# Altium schematic sheet Sheet_x_32.SchDoc
size A4
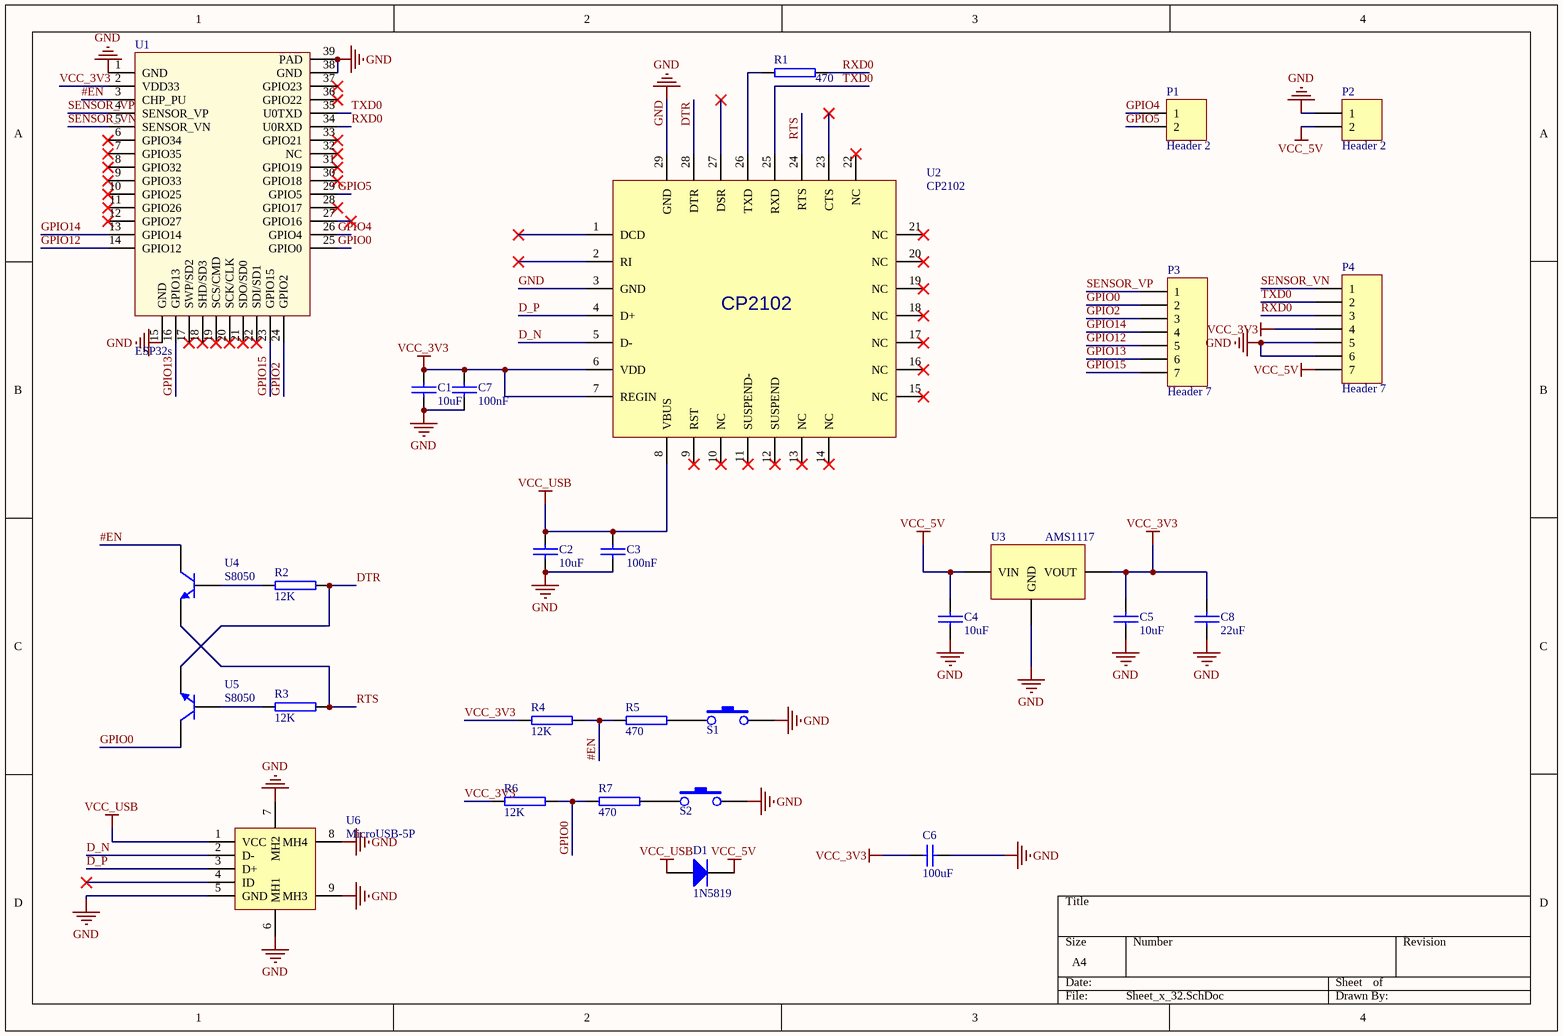
[diagram p0: Sheet_x_32.SchDoc]

## Parts
C1  10uF  [C0603]
C2  10uF  [C0603]
C3  100nF  [C0603]
C4  10uF  [C0603]
C5  10uF  [C0603]
C6  100uF  [C3528]
C7  100nF  [C0603]
C8  22uF  [C0603]
D1  1N5819  [1n4148]
P1  Header 2  [HDR1X2]
P2  Header 2  [HDR1X2]
P3  Header 7  [HDR1X7]
P4  Header 7  [HDR1X7]
R1  470  [R0603]
R2  12K  [R0603]
R3  12K  [R0603]
R4  12K  [R0603]
R5  470  [R0603]
R6  12K  [R0603]
R7  470  [R0603]
S1  贴片按钮  [switch]  (value not drawn)
S2  贴片按钮  [switch]  (value not drawn)
U1  ESP32s  [ESP32s]
U2  CP2102  [cp2102]
U3  AMS1117  [AMS1117]
U4  S8050  [s8050]
U5  S8050  [s8050]
U6  MicroUSB-5P  [MICROUSB_5S]

## Nets
GND: C1.2 C2.2 C3.2 C4.2 C5.2 C6.2 C7.2 C8.2 P2.1 P4.5 P4.6 S1.2 S2.2 U1.1(GND) U1.15(GND) U1.38(GND) U1.39(PAD) U2.3(GND) U2.29(GND) U3.1(GND) U6.5(GND) U6.6(MH1) U6.7(MH2) U6.8(MH4) U6.9(MH3)
VCC_3V3: C1.1 C5.1 C6.1 C7.1 C8.1 P4.4 R4.2 R6.2 U1.2(VDD33) U2.6(VDD) U2.7(REGIN) U3.2(VOUT)
VCC_5V: C4.1 D1.2(K) P2.2 P4.7 U3.3(VIN)
VCC_USB: C2.1 C3.1 D1.1(A) U2.8(VBUS) U6.1(VCC)
#EN: R4.1 R5.2 U1.3(CHP_PU) U4.3(C)
D_N: U2.5(D-) U6.2(D-)
D_P: U2.4(D+) U6.3(D+)
DTR: R2.2 U2.28(DTR) U5.2(E)
GPIO0: P3.2 R6.1 R7.2 U1.25(GPIO0) U5.3(C)
GPIO2: P3.3 U1.24(GPIO2)
GPIO4: P1.1 U1.26(GPIO4)
GPIO5: P1.2 U1.29(GPIO5)
GPIO12: P3.5 U1.14(GPIO12)
GPIO13: P3.6 U1.16(GPIO13)
GPIO14: P3.4 U1.13(GPIO14)
GPIO15: P3.7 U1.23(GPIO15)
RTS: R3.2 U2.24(RTS) U4.2(E)
RXD0: P4.3 R1.2 U1.34(U0RXD)
SENSOR_VN: P4.1 U1.5(SENSOR_VN)
SENSOR_VP: P3.1 U1.4(SENSOR_VP)
TXD0: P4.2 U1.35(U0TXD) U2.25(RXD)
NetR1_1: R1.1 U2.26(TXD)
NetR2_1: R2.1 U4.1(B)
NetR3_1: R3.1 U5.1(B)
NetR5_1: R5.1 S1.1
NetR7_1: R7.1 S2.1

Not connected (* = marked no-connect by the designer): U1 6(GPIO34)* 7(GPIO35)* 8(GPIO32)* 9(GPIO33)* 10(GPIO25)* 11(GPIO26)* 12(GPIO27)* 17(SWP/SD2)* 18(SHD/SD3)* 19(SCS/CMD)* 20(SCK/CLK)* 21(SDO/SD0)* 22(SDI/SD1)* 27(GPIO16)* 28(GPIO17)* 30(GPIO18)* 31(GPIO19)* 32(NC)* 33(GPIO21)* 36(GPIO22)* 37(GPIO23)*; U2 1(DCD)* 2(RI)* 9(RST)* 10(NC)* 11(SUSPEND-)* 12(SUSPEND)* 13(NC)* 14(NC)* 15(NC)* 16(NC)* 17(NC)* 18(NC)* 19(NC)* 20(NC)* 21(NC)* 22(NC)* 23(CTS)* 27(DSR)*; U6 4(ID)*

## Library data of the parts
C1-C5 C7 C8 = C0603: 贴片电容
C6 = Cap Semi: Capacitor 3.5x2.8mm; Published: 8-Jun-2000; LatestRevisionDate: 29-May-2009; LatestRevisionNote: IPC-7351 Footprint Added.; PackageReference: C1206; Publisher: Altium Limited; PackageDescription: Chip Capacitor; Value: 100uF
D1 = 1N4148: 二极管
P1 P2 = Header 2: Header, 2-Pin; LatestRevisionDate: 17-Jul-2002; LatestRevisionNote: Re-released for DXP Platform.; Publisher: Altium Limited
P3 P4 = Header 7: Header, 7-Pin; LatestRevisionDate: 17-Jul-2002; LatestRevisionNote: Re-released for DXP Platform.; Publisher: Altium Limited
R1-R7 = R0603: 贴片电阻
S1 S2 = Switch: 3*4*2mm开关
U1 = ESP32: WIFI&Bluetooth
U2 = CP2102: USB转串口芯片
U3 = AMS1117: 3.3V稳压芯片
U4 U5 = S8050: 三极管
U6 = MicroUSB_5S: Micro USB插脚